# EAGLE design v2164_quad_VCA (EAGLE 7.7.0)
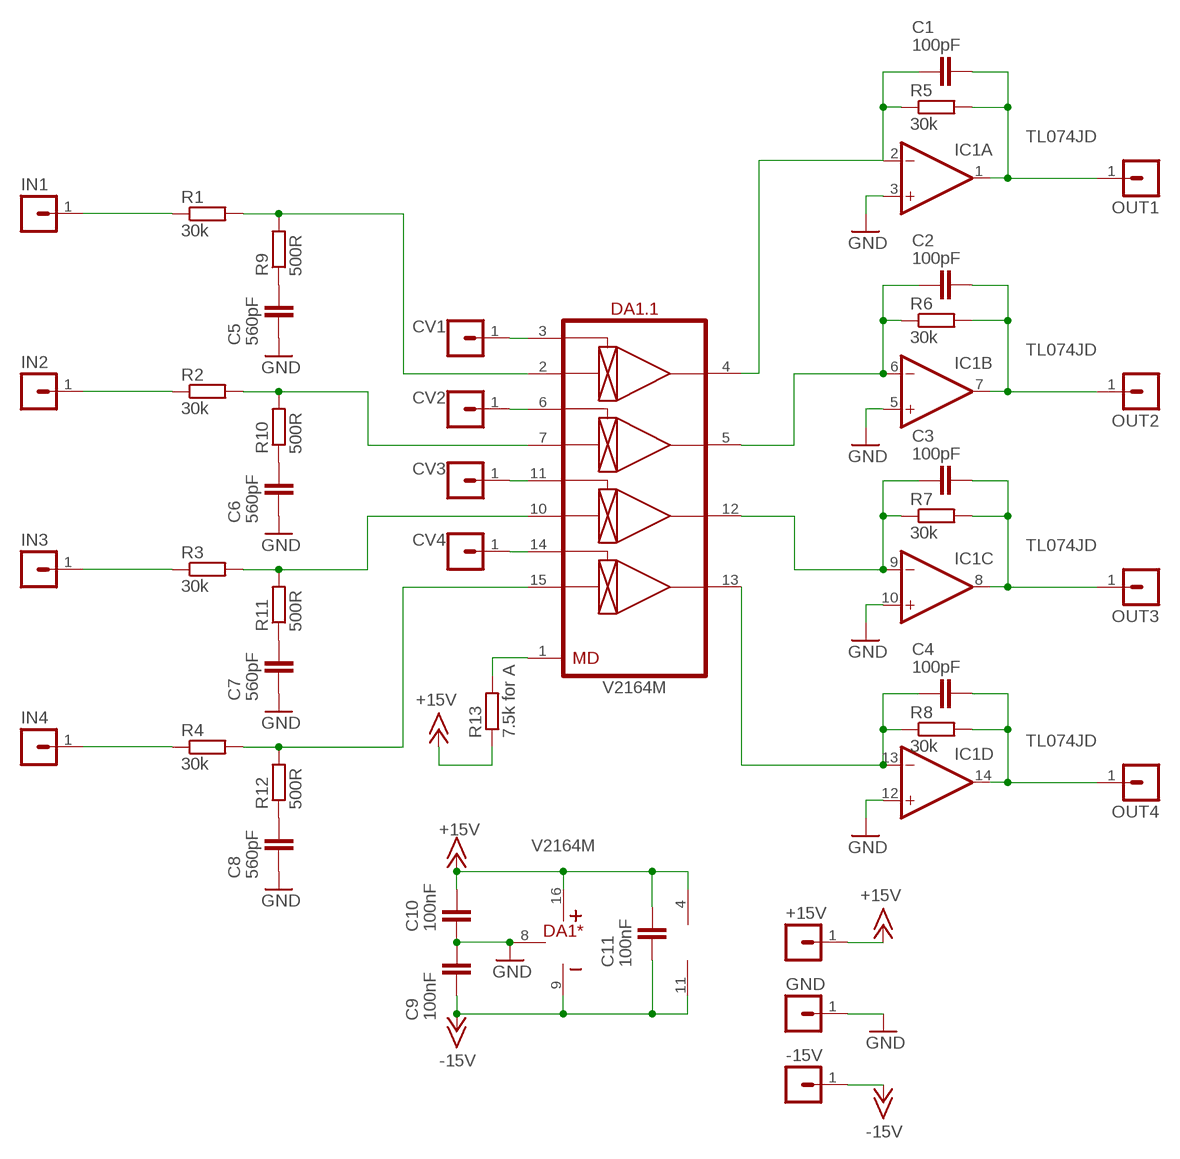
[diagram p0: schematic, sheet 1]

## Parts
+15V  MA01-1JN  [MA01N-1J]
-15V  MA01-1JN  [MA01N-1J]
C1  100pF  C-EUC0603  [C0603]
C2  100pF  C-EUC0603  [C0603]
C3  100pF  C-EUC0603  [C0603]
C4  100pF  C-EUC0603  [C0603]
C5  560pF  C-EUC0603  [C0603]
C6  560pF  C-EUC0603  [C0603]
C7  560pF  C-EUC0603  [C0603]
C8  560pF  C-EUC0603  [C0603]
C9  100nF  C-EUC0603  [C0603]
C10  100nF  C-EUC0603  [C0603]
C11  100nF  C-EUC0603  [C0603]
CV1  MA01-1JN  [MA01N-1J]
CV2  MA01-1JN  [MA01N-1J]
CV3  MA01-1JN  [MA01N-1J]
CV4  MA01-1JN  [MA01N-1J]
DA1  V2164M  [SO-16]
GND  MA01-1JN  [MA01N-1J]
IC1  TL074JD  [SO14J]
IN1  MA01-1JN  [MA01N-1J]
IN2  MA01-1JN  [MA01N-1J]
IN3  MA01-1JN  [MA01N-1J]
IN4  MA01-1JN  [MA01N-1J]
OUT1  MA01-1JN  [MA01N-1J]
OUT2  MA01-1JN  [MA01N-1J]
OUT3  MA01-1JN  [MA01N-1J]
OUT4  MA01-1JN  [MA01N-1J]
R1  30k  R-EU_R0603  [R0603]
R2  30k  R-EU_R0603  [R0603]
R3  30k  R-EU_R0603  [R0603]
R4  30k  R-EU_R0603  [R0603]
R5  30k  R-EU_R0603  [R0603]
R6  30k  R-EU_R0603  [R0603]
R7  30k  R-EU_R0603  [R0603]
R8  30k  R-EU_R0603  [R0603]
R9  500R  R-EU_R0603  [R0603]
R10  500R  R-EU_R0603  [R0603]
R11  500R  R-EU_R0603  [R0603]
R12  500R  R-EU_R0603  [R0603]
R13  7.5k for A  R-EU_R0603  [R0603]

## Nets
+15V: +15V.1 C10.2 C11.2 DA1.16(*:V+) IC1.4(P:V+) R13.1
-15V: -15V.1 C9.1 C11.1 DA1.9(*:V-) IC1.11(P:V-)
CV1: CV1.1 DA1.3(.1:CV1)
CV2: CV2.1 DA1.6(.1:CV2)
CV3: CV3.1 DA1.11(.1:CV3)
CV4: CV4.1 DA1.14(.1:CV4)
GND: C5.1 C6.1 C7.1 C8.1 C9.2 C10.1 DA1.8(*:GND) GND.1 IC1.3(A:+IN) IC1.5(B:+IN) IC1.10(C:+IN) IC1.12(D:+IN)
IN1: IN1.1 R1.1
IN2: IN2.1 R2.1
IN3: IN3.1 R3.1
IN4: IN4.1 R4.1
N$1: C4.1 DA1.13(.1:OUT4) IC1.13(D:-IN) R8.1
N$2: DA1.1(.1:MD) R13.2
N$3: C3.1 DA1.12(.1:OUT3) IC1.9(C:-IN) R7.1
N$5: C2.1 DA1.5(.1:OUT2) IC1.6(B:-IN) R6.1
N$7: C1.1 DA1.4(.1:OUT1) IC1.2(A:-IN) R5.1
N$9: C5.2 R9.1
N$10: C6.2 R10.1
N$11: C7.2 R11.1
N$12: C8.2 R12.1
N$17: DA1.2(.1:IN1) R1.2 R9.2
N$18: DA1.7(.1:IN2) R2.2 R10.2
N$19: DA1.10(.1:IN3) R3.2 R11.2
N$20: DA1.15(.1:IN4) R4.2 R12.2
OUT1: C1.2 IC1.1(A:OUT) OUT1.1 R5.2
OUT2: C2.2 IC1.7(B:OUT) OUT2.1 R6.2
OUT3: C3.2 IC1.8(C:OUT) OUT3.1 R7.2
OUT4: C4.2 IC1.14(D:OUT) OUT4.1 R8.2

## Library data of the parts
+15V -15V CV1-CV4 GND IN1-IN4 OUT1-OUT4 = joakim:MA01-1J: PIN HEADER
C1-C11 = rcl:C-EU: CAPACITOR, European symbol; SPICEPREFIX: C
DA1 = ic-coolaudio:V2164
IC1 = joakim:TL074J: OP AMP
R1-R13 = rcl:R-EU_: RESISTOR, European symbol; SPICEPREFIX: R

## Board
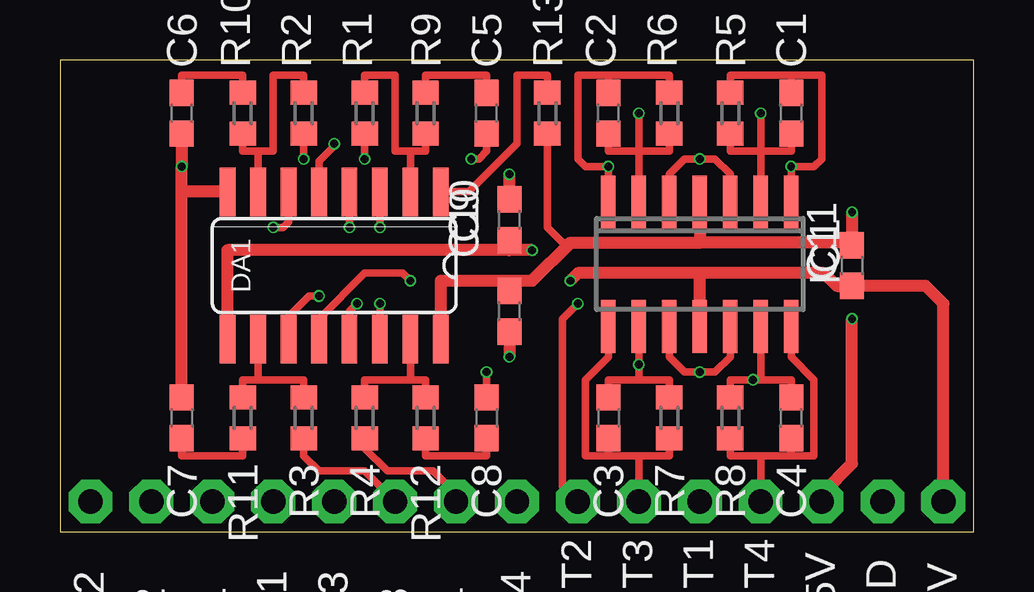
[diagram p1: board, top side]
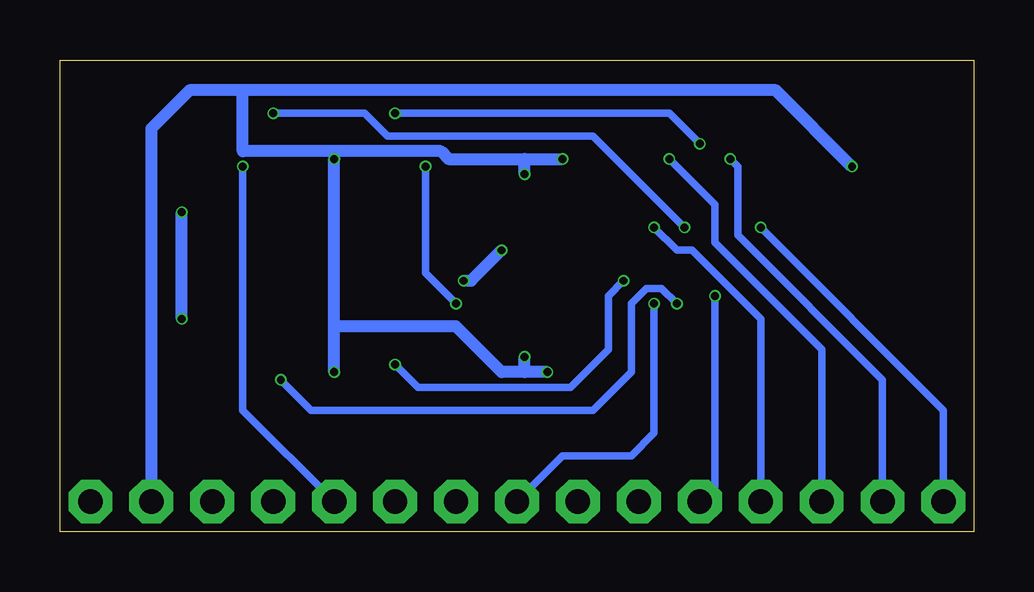
[diagram p2: board, bottom side, seen from below]

Size 38.1 x 19.68 mm. Coordinates in mm from the lower left corner, seen from the top.
Outline: 0,0 38.1,0 38.1,19.68 0,19.68 0,0
Copper layers (1*16): Top 0.035mm / dielectric 1.6mm / Bottom 0.035mm
Design rules "jlcpcb-2layers": minimum track width 5mil, minimum drill 0.3mm, track to track 5mil, track to pad 5mil, pad to pad 5mil, via to via 5mil, smd to smd 5mil, copper to edge 0.2mm, drill to drill 6mil, minimum pad ring 10mil, minimum via ring 3mil, stop-mask expansion 4mil, vias tented up to drill 0mil, thermal gap 10mil

### Footprints (pad centres in the part's own frame; a part is rotated, then mirrored left to right if it is on the bottom)
MA01N-1J = drill 1.016 octagon: 1 0,0
C0603 = smd 1.1 x 1: 1 -0.85,0; 2 0.85,0
SO-16 = smd 0.66 x 2.032: 1 -4.445,-3.073; 2 -3.175,-3.073; 3 -1.905,-3.073; 4 -0.635,-3.073; 5 0.635,-3.073; 6 1.905,-3.073; 7 3.175,-3.073; 8 4.445,-3.073; 9 4.445,3.073; 10 3.175,3.073; 11 1.905,3.073; 12 0.635,3.073; 13 -0.635,3.073; 14 -1.905,3.073; 15 -3.175,3.073; 16 -4.445,3.073
SO14J = smd 0.6 x 2.2: 1 -3.81,-2.6; 2 -2.54,-2.6; 3 -1.27,-2.6; 4 0,-2.6; 5 1.27,-2.6; 6 2.54,-2.6; 7 3.81,-2.6; 8 3.81,2.6; 9 2.54,2.6; 10 1.27,2.6; 11 0,2.6; 12 -1.27,2.6; 13 -2.54,2.6; 14 -3.81,2.6
R0603 = smd 1 x 1.1: 1 -0.85,0; 2 0.85,0

### Placement (x,y rotation side)
+15V  31.75,1.27 90 top
-15V  36.83,1.27 90 top
C1  30.48,17.46 90 top
C2  22.86,17.46 90 top
C3  22.86,4.76 270 top
C4  30.48,4.76 270 top
C5  17.78,17.46 90 top
C6  5.08,17.46 90 top
C7  5.08,4.76 270 top
C8  17.78,4.76 270 top
C9  18.73,13.02 90 top
C10  18.73,9.21 90 top
C11  33.02,11.11 90 top
CV1  8.89,1.27 90 top
CV2  1.27,1.27 90 top
CV3  11.43,1.27 90 top
CV4  19.05,1.27 90 top
DA1  11.43,11.11 180 top
GND  34.29,1.27 90 top
IC1  26.67,11.17 180 top
IN1  6.35,1.27 90 top
IN2  3.81,1.27 90 top
IN3  13.97,1.27 90 top
IN4  16.51,1.27 90 top
OUT1  26.67,1.27 90 top
OUT2  21.59,1.27 90 top
OUT3  24.13,1.27 90 top
OUT4  29.21,1.27 90 top
R1  12.7,17.46 90 top
R2  10.16,17.46 90 top
R3  10.16,4.76 90 top
R4  12.7,4.76 90 top
R5  27.94,17.46 90 top
R6  25.4,17.46 90 top
R7  25.4,4.76 270 top
R8  27.94,4.76 270 top
R9  15.24,17.46 270 top
R10  7.62,17.46 270 top
R11  7.62,4.76 90 top
R12  15.24,4.76 90 top
R13  20.32,17.46 90 top

### Tracks (layer width: path | path; a pad name or v marks a point on that pad's centre or on a via)
+15V  (via drill 0.33)
  Top 0.305: R13.1 20.32,12.7 20.95,12.06 21.27,12.06
  Top 0.508: IC1.4 26.67,12.06 | 26.67,12.06 32.92,12.06 C11.2 v33.02,13.34 | DA1.16 15.88,10.48 18.63,10.48 | 18.63,10.48 18.73,10.38 C10.2 | 18.63,10.48 19.68,10.48 21.27,12.06 26.67,12.06 | +15V.1 31.75,1.59 33.02,2.86 v33.02,8.89
  Bottom 0.508: v33.02,8.89 v33.02,13.34
-15V  (via drill 0.33)
  Top 0.508: IC1.11 26.67,10.79 | 26.67,10.79 31.85,10.79 32.38,10.26 C11.1 36.09,10.26 36.83,9.53 -15V.1 | 26.67,10.79 21.59,10.79 v21.27,10.48 | DA1.9 6.99,11.75 18.73,11.75 | C9.1 18.73,11.75 | v19.68,11.75 18.73,11.75
  Bottom 0.508: v21.27,10.48 20.95,10.48 v19.68,11.75
CV1  (via drill 0.33)
  Top 0.305: DA1.3 v13.34,12.7
  Bottom 0.305: v13.34,12.7 12.38,11.75 11.75,11.75 8.89,8.89 CV1.1
CV2  (via drill 0.33)
  Top 0.305: v8.89,12.7 9.31,12.7 9.53,12.92 DA1.6
  Bottom 0.305: v8.89,12.7 1.27,5.08 CV2.1
CV3  (via drill 0.33)
  Top 0.305: DA1.11 9.53,8.99 10.38,9.84 v10.79,9.84
  Bottom 0.305: CV3.1 10.79,1.91 v10.79,9.84
CV4  (via drill 0.33)
  Top 0.305: DA1.14 v13.34,9.53
  Bottom 0.305: CV4.1 17.14,3.17 14.29,3.17 13.34,4.13 v13.34,9.53
GND  (via drill 0.33)
  Top 0.305: IC1.5 25.4,14.92 26.04,15.56 v26.67,15.56 27.3,15.56 27.94,14.92 IC1.3 | IC1.10 25.4,7.3 26.04,6.67 v26.67,6.67 27.3,6.67 27.94,7.3 IC1.12 | C5.1 17.78,15.88 17.46,15.56 v17.14,15.56 | C8.1 v17.78,6.67
  Top 0.508: C7.1 5.08,14.29 | C6.1 v5.08,15.24 5.08,14.29 | 5.08,14.29 5.18,14.19 DA1.8 | C9.2 v18.73,14.92 | C10.1 v18.73,7.3
  Bottom 0.508: v26.67,6.67 26.67,8.57 | 26.67,8.57 v26.67,15.56 26.67,15.88 | 26.67,15.88 22.23,15.88 21.91,15.56 18.73,15.56 | v17.78,6.67 18.73,6.67 | 18.73,6.67 19.68,6.67 21.59,8.57 26.67,8.57 | v5.08,15.24 8.26,18.41 30.48,18.41 | 30.48,18.41 32.7,18.41 34.29,16.83 GND.1 | 18.73,15.56 v17.14,15.56 | 18.73,6.67 v18.73,7.3 | v18.73,14.92 18.73,15.56 | 26.67,15.88 30.48,15.88 30.48,18.41
IN1  (via drill 0.33)
  Top 0.305: v12.7,15.56 R1.1
  Bottom 0.305: v12.7,15.56 10.79,13.65 10.79,12.06 6.35,7.62 IN1.1
IN2  (via drill 0.33)
  Top 0.305: R2.1 v10.16,15.56
  Bottom 0.305: v10.16,15.56 9.84,15.24 9.84,12.38 3.81,6.35 IN2.1
IN3
  Top 0.305: IN3.1 12.7,2.54 10.79,2.54 10.16,3.17 R3.1
IN4
  Top 0.305: IN4.1 16.51,1.59 15.56,2.54 13.65,2.54 12.7,3.49 R4.1
N$1  (via drill 0.33)
  Top 0.305: IC1.13 29.21,6.35 v28.89,6.35 | v12.38,9.53 12.06,9.21 DA1.13 | R8.1 27.94,6.35 v28.89,6.35 | v28.89,6.35 30.48,6.35 C4.1
  Bottom 0.305: v12.38,9.53 13.02,10.16 13.65,10.16 14.29,9.53 14.29,6.67 15.88,5.08 27.62,5.08 v28.89,6.35
N$2
  Top 0.305: DA1.1 17.04,14.19 19.05,16.19 19.05,19.05 20.32,19.05 R13.2
N$3  (via drill 0.33)
  Top 0.305: IC1.9 v24.13,6.99 24.13,6.35 | DA1.12 10.79,8.89 12.7,10.79 14.29,10.79 v14.61,10.48 | C3.1 22.86,6.35 24.13,6.35 | 24.13,6.35 25.4,6.35 R7.1
  Bottom 0.305: v24.13,6.99 23.18,6.03 16.83,6.03 15.24,7.62 15.24,9.84 v14.61,10.48
N$5  (via drill 0.33)
  Top 0.305: v11.43,16.19 11.43,16.09 10.79,15.46 DA1.5 | v24.13,17.46 24.13,15.88 | 24.13,15.88 25.4,15.88 R6.1 | C2.1 22.86,15.88 24.13,15.88 | IC1.6 24.13,15.88
  Bottom 0.305: v24.13,17.46 12.7,17.46 v11.43,16.19
N$7  (via drill 0.33)
  Top 0.305: DA1.4 v12.06,12.7 | R5.1 27.94,15.88 29.21,15.88 | 29.21,15.88 30.48,15.88 C1.1 | IC1.2 29.21,15.88 | v29.21,17.46 29.21,15.88
  Bottom 0.305: v12.06,12.7 15.88,16.51 24.45,16.51 25.4,17.46 v29.21,17.46
N$9
  Top 0.305: C5.2 17.78,19.05 15.24,19.05 R9.1
N$10
  Top 0.305: C6.2 5.08,19.05 7.62,19.05 R10.1
N$11
  Top 0.305: C7.2 5.08,3.17 7.62,3.17 R11.1
N$12
  Top 0.305: R12.1 15.24,3.17 17.78,3.17 C8.2
N$17
  Top 0.305: 14.61,15.88 DA1.2 | 14.61,15.88 13.97,15.88 13.97,19.05 12.7,19.05 R1.2 | 14.61,15.88 15.24,15.88 R9.2
N$18
  Top 0.305: DA1.7 8.26,15.88 | 8.26,15.88 7.62,15.88 R10.2 | 8.26,15.88 8.89,15.88 8.89,19.05 10.16,19.05 R2.2
N$19
  Top 0.305: DA1.10 8.26,6.35 | 8.26,6.35 7.62,6.35 R11.2 | 8.26,6.35 10.16,6.35 R3.2
N$20
  Top 0.305: DA1.15 14.61,6.35 | 14.61,6.35 15.24,6.35 R12.2 | R4.2 12.7,6.35 14.61,6.35
OUT1  (via drill 0.33)
  Top 0.305: IC1.1 v30.48,15.24 31.43,15.24 31.75,15.56 31.75,19.05 30.48,19.05 | R5.2 27.94,19.05 30.48,19.05 | 30.48,19.05 C1.2
  Bottom 0.305: v30.48,15.24 30.48,5.08 OUT1.1
OUT2  (via drill 0.33)
  Top 0.305: IC1.7 v22.86,15.24 21.91,15.24 21.59,15.56 21.59,19.05 22.86,19.05 | v21.59,9.53 20.95,8.89 20.95,1.91 OUT2.1 | C2.2 22.86,19.05 | 22.86,19.05 25.4,19.05 R6.2
  Bottom 0.305: v22.86,15.24 22.86,10.79 v21.59,9.53
OUT3
  Top 0.305: IC1.8 22.86,7.3 21.91,6.35 21.91,3.17 22.86,3.17 | C3.2 22.86,3.17 | 22.86,3.17 24.13,3.17 | 24.13,3.17 25.4,3.17 R7.2 | OUT3.1 24.13,3.17
OUT4
  Top 0.305: R8.2 27.94,3.17 29.21,3.17 | 29.21,3.17 30.48,3.17 | 30.48,3.17 C4.2 | IC1.14 30.48,7.3 31.43,6.35 31.43,3.17 30.48,3.17 | OUT4.1 29.21,3.17